# EAGLE design hw-art_v1 (EAGLE 6.1)
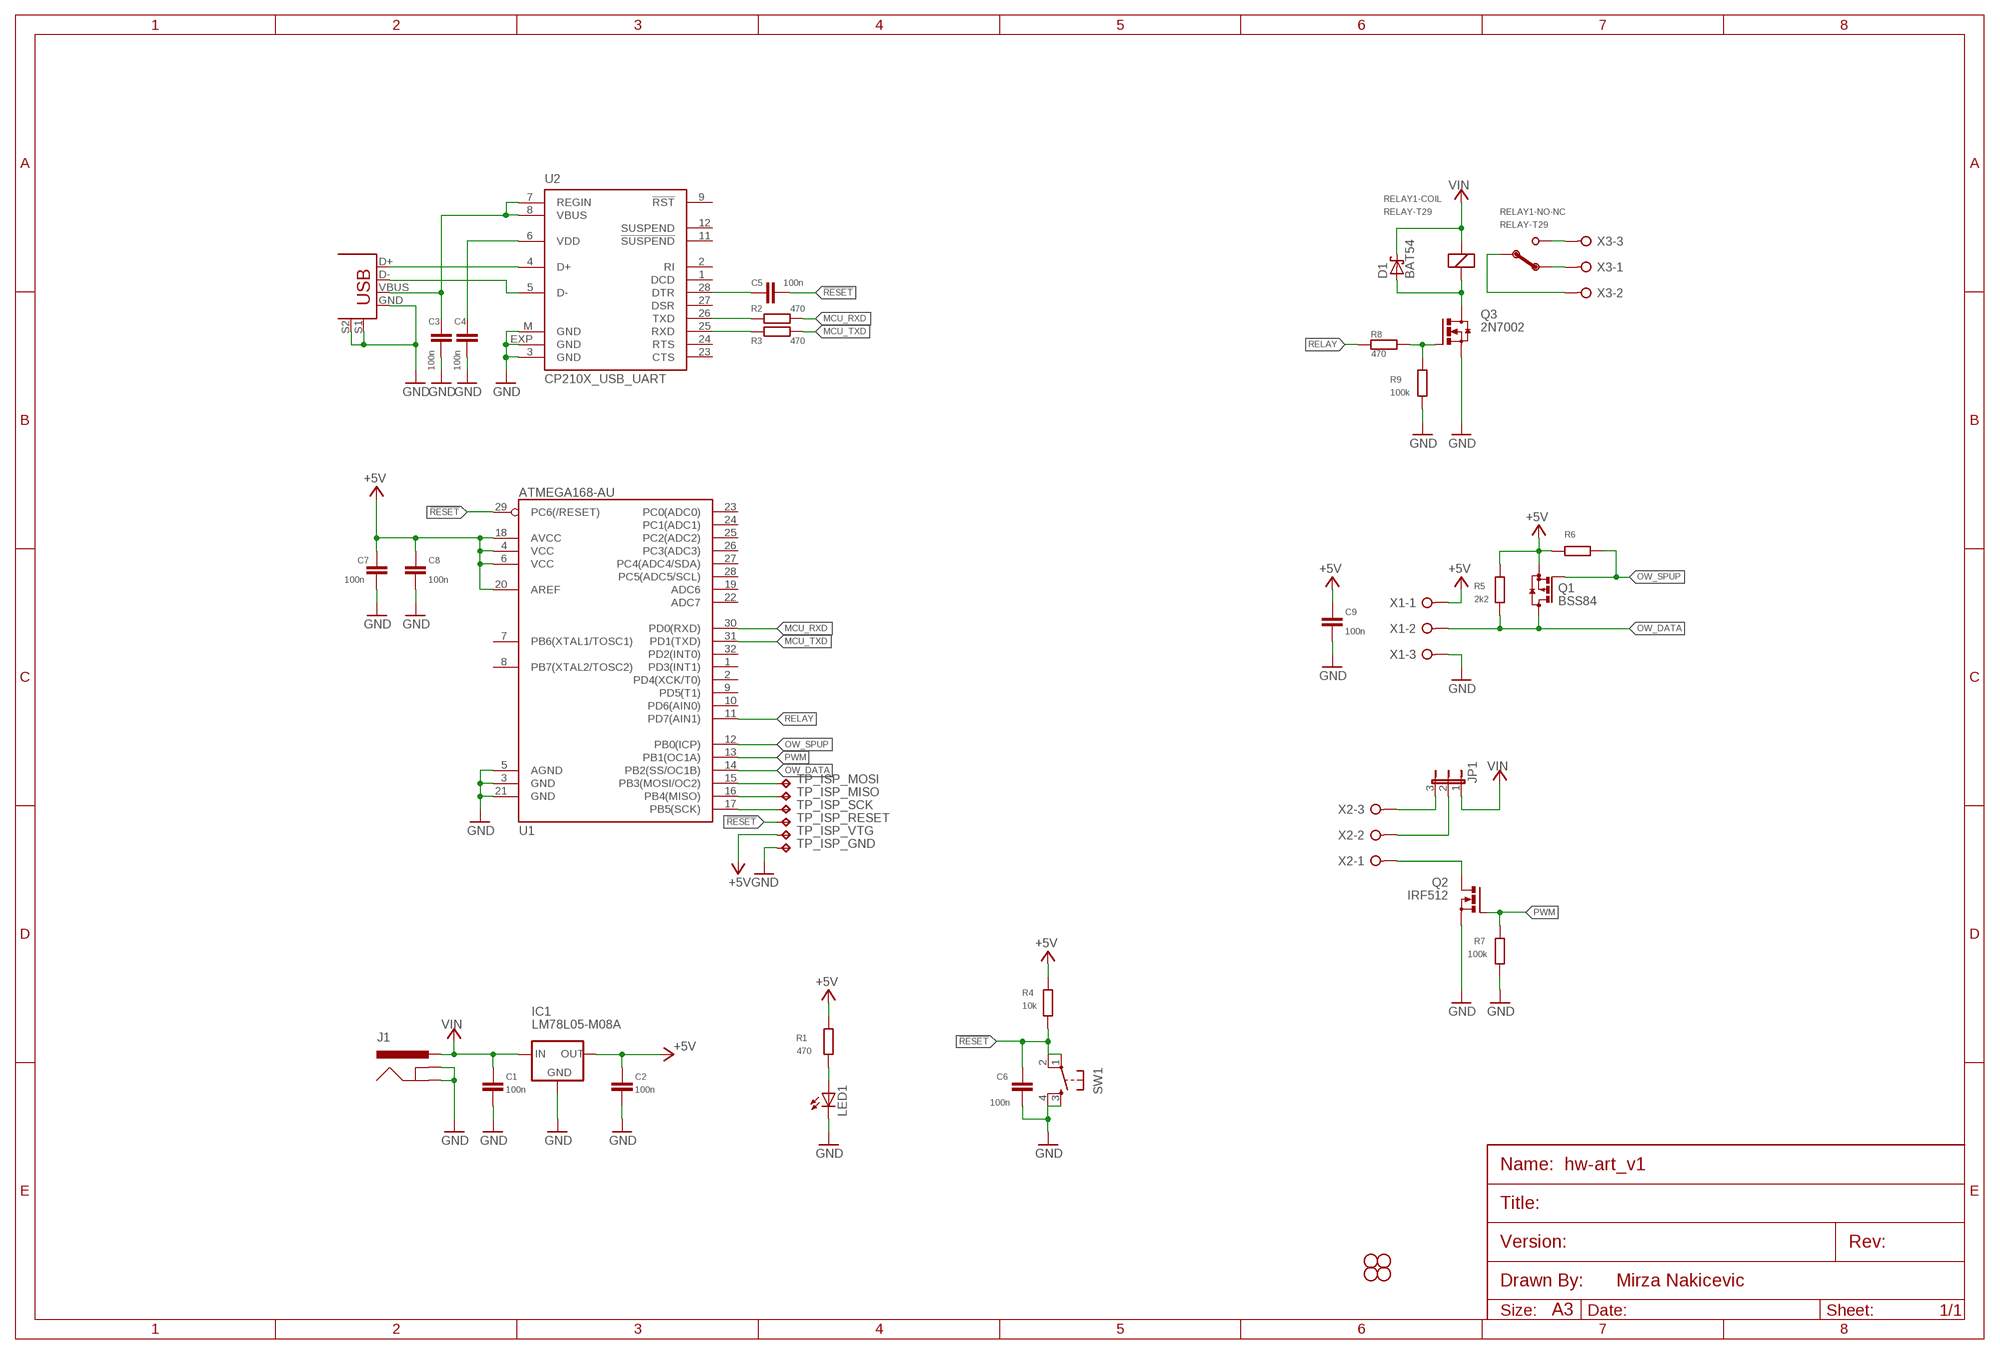
[diagram p0: schematic, sheet 1]

## Parts
C1  100n  C-0603  [C0603]
C2  100n  C-0603  [C0603]
C3  100n  C-0603  [C0603]
C4  100n  C-0603  [C0603]
C5  100n  C-0603  [C0603]
C6  100n  C-0603  [C0603]
C7  100n  C-0603  [C0603]
C8  100n  C-0603  [C0603]
C9  100n  C-0603  [C0603]
D1  BAT54  [SOT23]
IC1  LM78L05-M08A  [SO-08]
J1  DCJACK-05537  [4UCON-05537]
J2  USB+SHIELD  [USB-B-PTH]
JP1  JP2E  [JP2]
LED1  LEDCHIP-LED0805  [CHIP-LED0805]
Q1  BSS84  [SOT23]
Q2  IRF512  [TO220BV]
Q3  2N7002  [SOT-23]
R1  470  R-0603  [R0603]
R2  470  R-0603  [R0603]
R3  470  R-0603  [R0603]
R4  10k  R-0603  [R0603]
R5  2k2  R-0603  [R0603]
R6  R-0603  [R0603]
R7  100k  R-0603  [R0603]
R8  470  R-0603  [R0603]
R9  100k  R-0603  [R0603]
RELAY1  RELAY-T29  [FINDER_T29]
SW1  TAC_SWITCHPTH  [TACTILE-PTH]
TP_ISP_GND  TPTP08R  [TP08R]
TP_ISP_MISO  TPTP08R  [TP08R]
TP_ISP_MOSI  TPTP08R  [TP08R]
TP_ISP_RESET  TPTP08R  [TP08R]
TP_ISP_SCK  TPTP08R  [TP08R]
TP_ISP_VTG  TPTP08R  [TP08R]
U1  ATMEGA168-AU  [TQFP32-08]
U2  CP210X_USB_UART  [MLP28]
U$1  STAND-OFF  [STAND-OFF]
U$2  STAND-OFF  [STAND-OFF]
U$3  STAND-OFF  [STAND-OFF]
U$4  STAND-OFF  [STAND-OFF]
X1  W237-03P  [W237-133]
X2  W237-03P  [W237-133]
X3  W237-03P  [W237-133]

## Nets
!RESET: C5.2 C6.2 R4.1 SW1.1 SW1.2 TP_ISP_RESET.TP U1.29(PC6(/RESET))
+5V: C2.1 C7.1 C8.1 C9.1 IC1.1(OUT) Q1.2(S) R1.2 R4.2 R5.2 R6.1 TP_ISP_VTG.TP U1.4(VCC) U1.6(VCC) U1.18(AVCC) U1.20(AREF) X1.1
GND: C1.2 C2.2 C3.2 C4.2 C6.1 C7.2 C8.2 C9.2 IC1.2(GND) IC1.3(GND) IC1.6(GND) IC1.7(GND) J1.2(GND) J1.3(GNDBREAK) J2.GND J2.S1 J2.S2 LED1.C Q2.S Q3.2(S) R7.2 R9.1 SW1.3 SW1.4 TP_ISP_GND.TP U1.3(GND) U1.5(AGND) U1.21(GND) U2.3(GND) U2.EXP(GND) U2.M(GND) X1.3
MCU_RXD: R2.2 U1.30(PD0(RXD))
MCU_TXD: R3.2 U1.31(PD1(TXD))
N$1: J2.D+ U2.4(D+)
N$2: J2.D- U2.5(D-)
N$3: C4.1 U2.6(VDD)
N$4: R2.1 U2.26(TXD)
N$5: R3.1 U2.25(RXD)
N$6: C5.1 U2.28(DTR)
N$7: RELAY1.NC(-NO-NC:NC) X3.1
N$9: Q2.D X2.1
N$10: JP1.3 X2.3
N$11: LED1.A R1.1
N$12: JP1.2 X2.2
N$13: TP_ISP_MOSI.TP U1.15(PB3(MOSI/OC2))
N$14: TP_ISP_MISO.TP U1.16(PB4(MISO))
N$15: TP_ISP_SCK.TP U1.17(PB5(SCK))
N$16: RELAY1.NO(-NO-NC:NO) X3.3
N$18: D1.1(A) Q3.3(D) RELAY1.-
N$19: RELAY1.COM(-NO-NC:COM) X3.2
N$22: Q3.1(G) R8.1 R9.2
OW_DATA: Q1.3(D) R5.1 U1.14(PB2(SS/OC1B)) X1.2
OW_SPUP: Q1.1(G) R6.2 U1.12(PB0(ICP))
PWM: Q2.G R7.1 U1.13(PB1(OC1A))
RELAY: R8.2 U1.11(PD7(AIN1))
VBUS: C3.1 J2.VBUS U2.7(REGIN) U2.8(VBUS)
VIN: C1.1 D1.3(C) IC1.8(IN) J1.1(PWR) JP1.1 RELAY1.+
Unconnected: U1.1(PD3(INT1)) U1.2(PD4(XCK/T0)) U1.7(PB6(XTAL1/TOSC1)) U1.8(PB7(XTAL2/TOSC2)) U1.9(PD5(T1)) U1.10(PD6(AIN0)) U1.19(ADC6) U1.22(ADC7) U1.23(PC0(ADC0)) U1.24(PC1(ADC1)) U1.25(PC2(ADC2)) U1.26(PC3(ADC3)) U1.27(PC4(ADC4/SDA)) U1.28(PC5(ADC5/SCL)) U1.32(PD2(INT0)) U2.1(DCD) U2.2(RI) U2.9(!RST) U2.11(!SUSPEND) U2.12(SUSPEND) U2.23(CTS) U2.24(RTS) U2.27(DSR)

## Notes on the sheet
- Mirza Nakicevic

## Library data of the parts
C1-C9 = rlc:C: Capacitor Standard SMD ceramic and 0.1" leaded capacitors.
D1 = diode:BAT54: Schottky Diodes Source: Fairchild .. BAT54.pdf
IC1 = ic-dcdc:LM78L05
J1 = con-jack:DCJACK
J2 = SparkFun:USB+SHIELD: USB+Shield USB connector with shield pins connectable
JP1 = jumper:JP2E: JUMPER
LED1 = led:LED: LED OSRAM: - CHIPLED LG R971, LG N971, LY N971, LG Q971, LY Q971, LO R971, LY R971 LH N974, LH R974 LS Q976, LO Q976, LY Q976 LO Q996 - Hyper CHIPLED LW Q18S LB Q993, LB Q99A, LB R99A - SideLED LS A670, LO A670, LY A670, LG A670, LP A670 LB A673, LV A673, LT A673, LW A673 LH A674 LY A675 LS A676, LA A676, LO A676, LY A676, LW A676 LS A679, LY A679, LG A679 - Hyper Micro SIDELED® LS Y876, LA Y876, LO Y876, LY Y876 LT Y87S - SmartLED LW L88C, LW L88S LB L89C, LB L89S, LG L890 LS L89K, LO L89K, LY L89K LS L896, LA L896, LO L896, LY L896 - TOPLED LS T670, LO T670, LY T670, LG T670, LP T670 LSG T670, LSP T670, LSY T670, LOP T670, LYG T670 LG T671, LOG T671, LSG T671 LB T673, LV T673, LT T673, LW T673 LH T674 LS T676, LA T676, LO T676, LY T676, LB T676, LH T676, LSB T676, LW T676 LB T67C, LV T67C, LT T67C, LS T67K, LO T67K, LY T67K, LW E67C LS E67B, LA E67B, LO E67B, LY E67B, LB E67C, LV E67C, LT E67C LW T67C LS T679, LY T679, LG T679 LS T770, LO T770, LY T770, LG T770, LP T770 LB T773, LV T773, LT T773, LW T773 LH T774 LS E675, LA E675, LY E675, LS T675 LS T776, LA T776, LO T776, LY T776, LB T776 LHGB T686 LT T68C, LB T68C - Hyper Mini TOPLED® LB M676 - Mini TOPLED Santana® LG M470 LS M47K, LO M47K, LY M47K Source: http://www.osram.convergy.de LUXEON: - LUMILED® LXK2-PW12-R00, LXK2-PW12-S00, LXK2-PW14-U00, LXK2-PW14-V00 LXK2-PM12-R00, LXK2-PM12-S00, LXK2-PM14-U00 LXK2-PE12-Q00, LXK2-PE12-R00, LXK2-PE12-S00, LXK2-PE14-T00, LXK2-PE14-U00 LXK2-PB12-K00, LXK2-PB12-L00, LXK2-PB12-M00, LXK2-PB14-N00, LXK2-PB14-P00, LXK2-PB14-Q00 LXK2-PR12-L00, LXK2-PR12-M00, LXK2-PR14-Q00, LXK2-PR14-R00 LXK2-PD12-Q00, LXK2-PD12-R00, LXK2-PD12-S00 LXK2-PH12-R00, LXK2-PH12-S00 LXK2-PL12-P00, LXK2-PL12-Q00, LXK2-PL12-R00 Source: www.luxeon.com KINGBRIGHT: KA-3528ASYC Source: www.kingbright.com
Q1 = transistor-small-signal:BSS84: P-CHANNEL MOS FET
Q2 = transistor-power:IRF512: N-CHANNEL MOS FET
Q3 = transistor-fet:2N7002
R1-R9 = rlc:R: Resistor Basic schematic elements and footprints for 0603, 1206, and PTH 1/10th watt (small) resistors.
RELAY1 = relay:RELAY
SW1 = switch:TAC_SWITCH: Momentary Switch Button commonly used for reset or general input.
TP_ISP_GND TP_ISP_MISO TP_ISP_MOSI TP_ISP_RESET TP_ISP_SCK TP_ISP_VTG = testpad:TP: Test pad
U1 = mcu-avr:ATMEGA168
U2 = SparkFun:CP210X_USB_UART: Single-Chip USB to UART Bridge Source: www.silabs.com .. CP2101.pdf / cp2102.pdf. Spark Fun Electronics SKU : COM-00310
U$1-U$4 = other:STAND-OFF: Stand Off This is the mechanical footprint for a #4 phillips button head screw. Use the keepout ring to avoid running the screw head into surrounding components.
X1-X3 = con-wago-508:W237-03P: WAGO SREW CLAMP; OC_FARNELL: unknown; OC_NEWARK: unknown

## Board
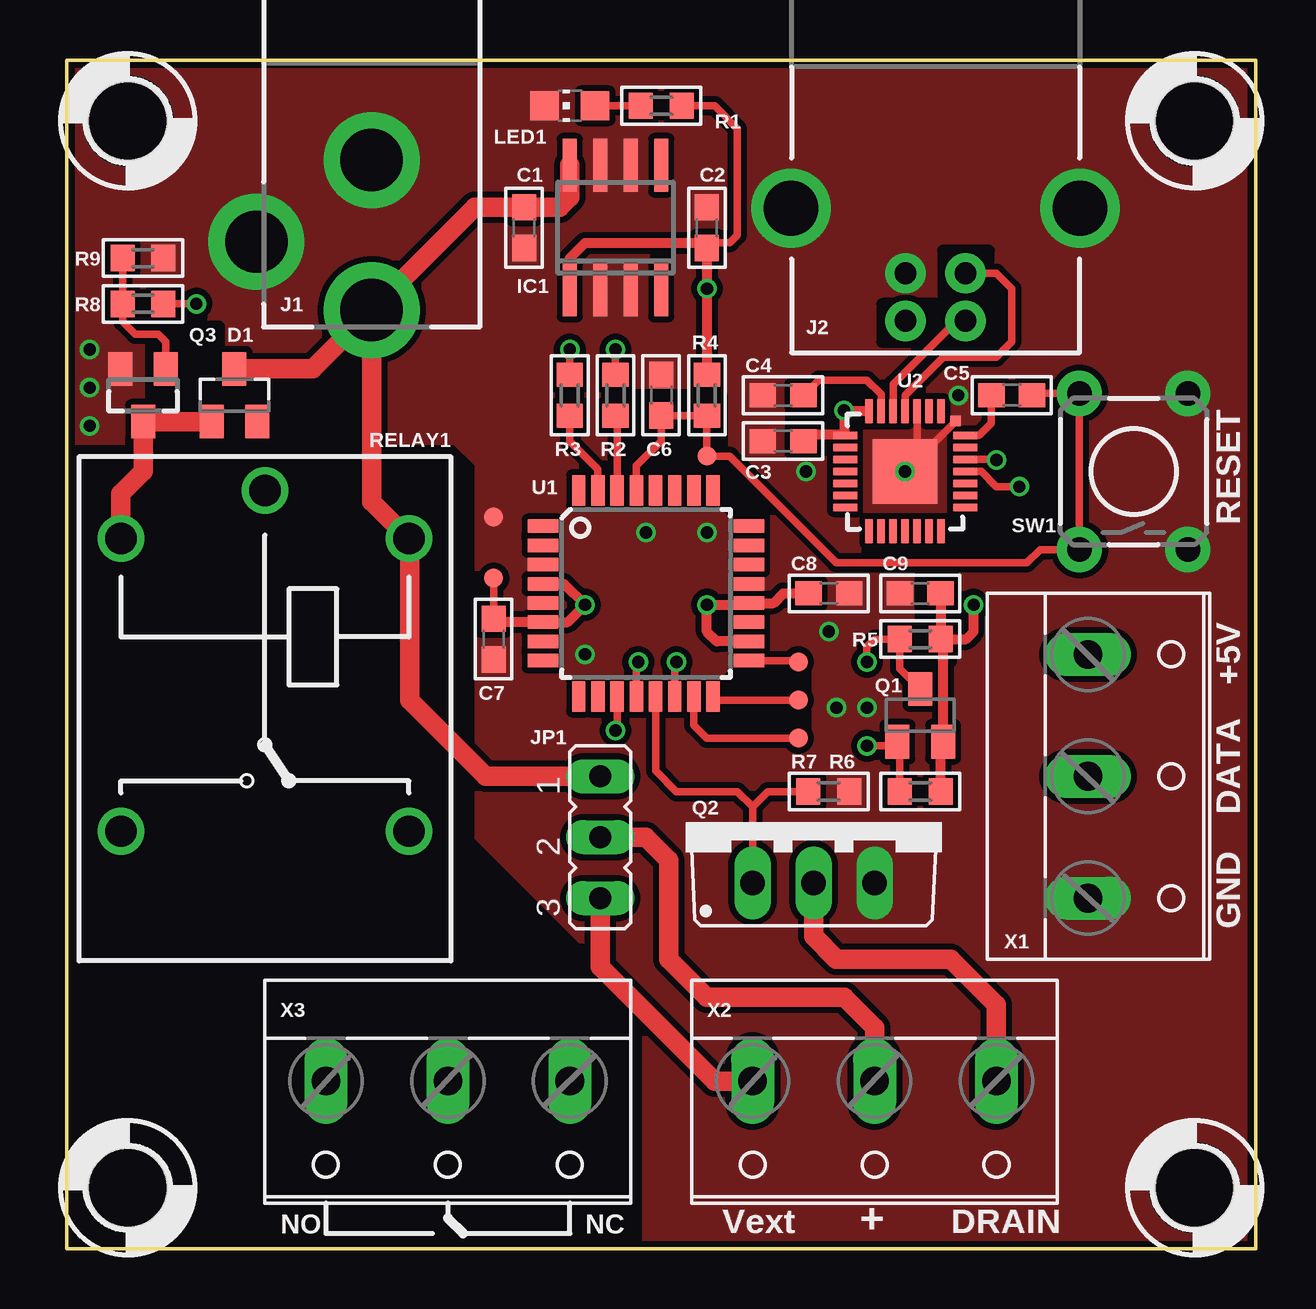
[diagram p1: board, top side]
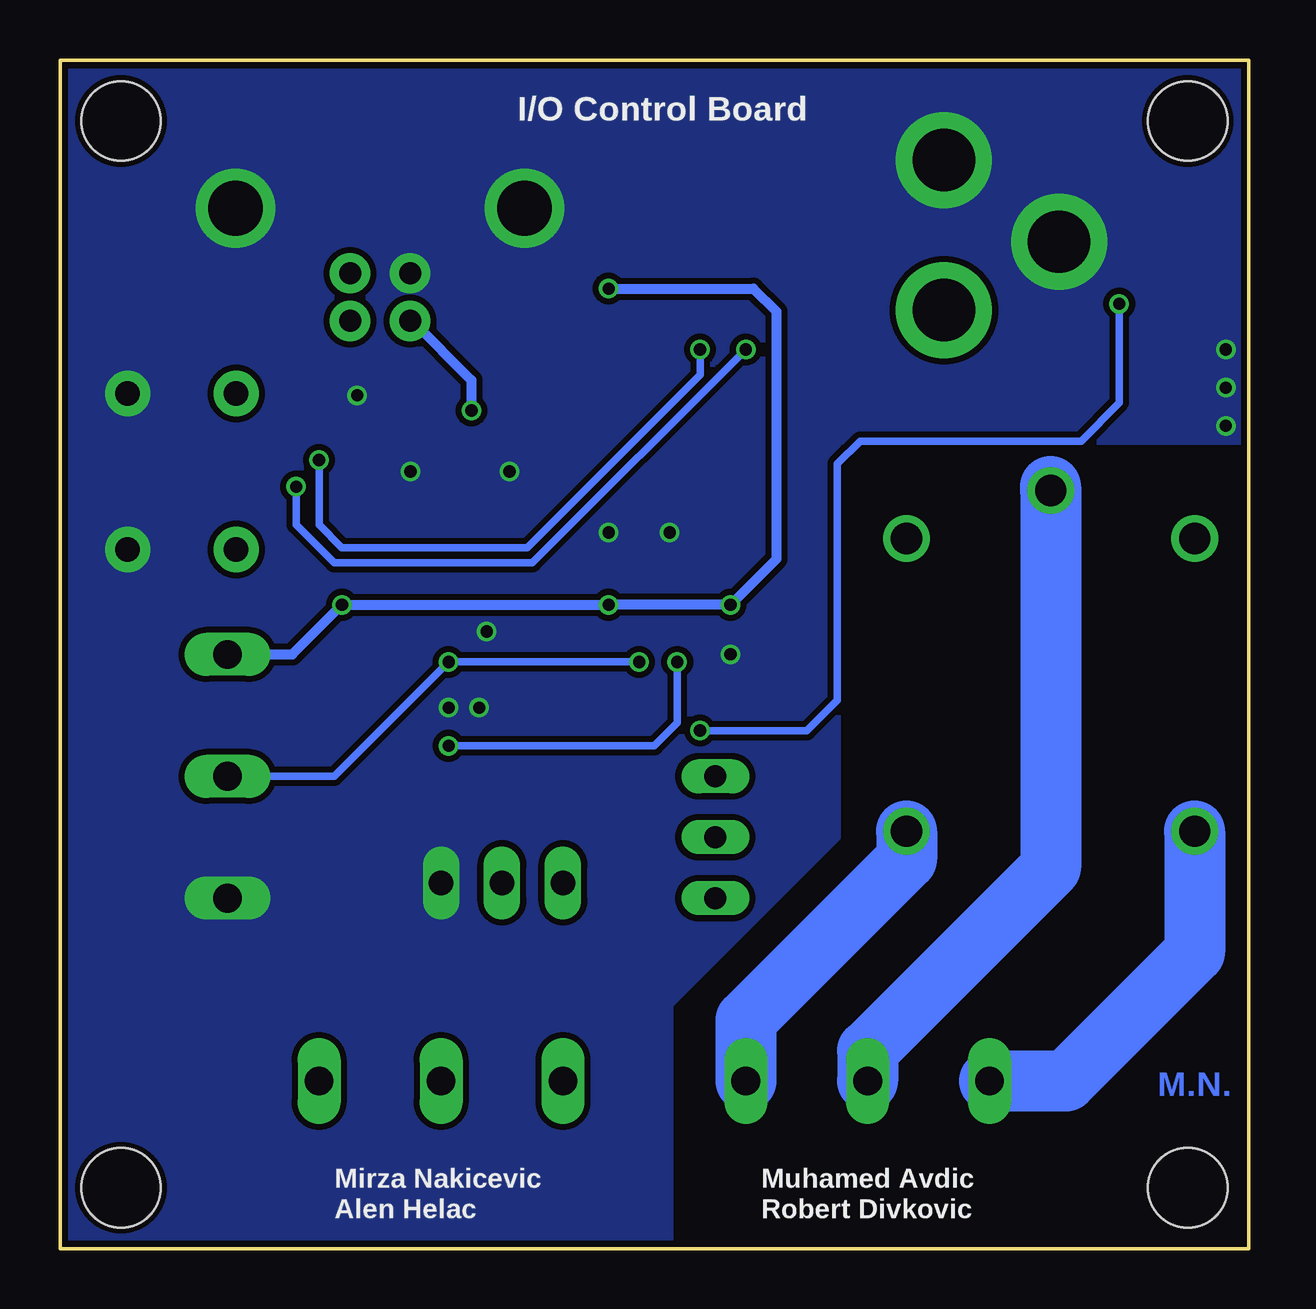
[diagram p2: board, bottom side, seen from below]

Size 49.53 x 49.53 mm. Coordinates in mm from the lower left corner, seen from the top.
Outline: 0,0 49.53,0 49.53,49.53 0,49.53 0,0
Copper layers (1*16): Top 0.035mm / dielectric 1.5mm / Bottom 0.035mm
Design rules: minimum track width 6mil, minimum drill 12mil, track to track 6mil, track to pad 6mil, pad to pad 6mil, via to via 6mil, smd to smd 0mil, copper to edge 10mil, drill to drill 10mil, minimum pad ring 10mil, minimum via ring 6mil, stop-mask expansion 2mil, vias tented up to drill 100mil, thermal gap 10mil
tRestrict: area 3.5,35.2 to 6.3,38.4; area 23.5,32.4 to 27.3,35.6; area 30.2,33.3 to 31.4,35.9; area 27.6,30.8 to 28.6,31.8; area 36.5,37.8 to 38.4,41.6; area 34,37.8 to 36.5,39.4; area 35.6,24.4 to 36.8,28.3; area 29.2,21.3 to 30.8,24.4; area 27.6,23.2 to 29.2,23.8

### Footprints (pad centres in the part's own frame; a part is rotated, then mirrored left to right if it is on the bottom)
C0603 = smd 1.1 x 1: 1 -0.85,0; 2 0.85,0
SOT23 = smd 1 x 1.4: 1 -0.95,-1.1; 2 0.95,-1.1; 3 0,1.1
SO-08 = smd 0.6 x 2.2: 1 -1.905,-2.6; 2 -0.635,-2.6; 3 0.635,-2.6; 4 1.905,-2.6; 5 1.905,2.6; 6 0.635,2.6; 7 -0.635,2.6; 8 -1.905,2.6
4UCON-05537 = drill 2.6 pad 4: 1 9.79,0; 2 3.54,0; 3 6.94,-4.8
USB-B-PTH = drill 0.914 pad 1.676: D+ 0,1.25; D- 1.981,1.25; GND 0,-1.25; VBUS 1.981,-1.25 | drill 2.286: S1 -2.718,-6.02; S2 -2.718,6.02
JP2 = drill 0.914 long: 1 -2.54,0; 2 0,0; 3 2.54,0
CHIP-LED0805 = smd 1.2 x 1.2: A 0,-1.05; C 0,1.05
TO220BV = drill 1.016 long: D 0,-2.54; G -2.54,-2.54; S 2.54,-2.54
SOT-23 = smd 1 x 1.4: 1 -0.95,-1.1; 2 0.95,-1.1; 3 0,1.1
R0603 = smd 1 x 1.1: 1 -0.85,0; 2 0.85,0
FINDER_T29 = drill 1.3: + -6.1,6; - -6.1,-6; COM -8.1,0; NC 6.1,6; NO 6.1,-6
TACTILE-PTH = drill 1.016 pad 1.88: 1 -3.251,2.261; 2 3.251,2.261; 3 -3.251,-2.261; 4 3.251,-2.261
TP08R = smd 0.8 x 0.8: TP 0,0
TQFP32-08 = smd 1.27 x 0.559: 1 -4.293,2.8; 2 -4.293,2; 3 -4.293,1.2; 4 -4.293,0.4; 5 -4.293,-0.4; 6 -4.293,-1.2; 7 -4.293,-2; 8 -4.293,-2.8; 17 4.293,-2.8; 18 4.293,-2; 19 4.293,-1.2; 20 4.293,-0.4; 21 4.293,0.4; 22 4.293,1.2; 23 4.293,2; 24 4.293,2.8 | smd 0.559 x 1.27: 9 -2.8,-4.293; 10 -2,-4.293; 11 -1.2,-4.293; 12 -0.4,-4.293; 13 0.4,-4.293; 14 1.2,-4.293; 15 2,-4.293; 16 2.8,-4.293; 25 2.8,4.293; 26 2,4.293; 27 1.2,4.293; 28 0.4,4.293; 29 -0.4,4.293; 30 -1.2,4.293; 31 -2,4.293; 32 -2.8,4.293
MLP28 = smd 1 x 0.3: 1 -2.5,1.5; 2 -2.5,1; 3 -2.5,0.5; 4 -2.5,0; 5 -2.5,-0.5; 6 -2.5,-1; 7 -2.5,-1.5; 15 2.5,-1.5; 16 2.5,-1; 17 2.5,-0.5; 18 2.5,0; 19 2.5,0.5; 20 2.5,1; 21 2.5,1.5 | smd 0.3 x 1: 8 -1.5,-2.5; 9 -1,-2.5; 10 -0.5,-2.5; 11 0,-2.5; 12 0.5,-2.5; 13 1,-2.5; 14 1.5,-2.5; 22 1.5,2.5; 23 1,2.5; 24 0.5,2.5; 25 0,2.5; 26 -0.5,2.5; 27 -1,2.5; 28 -1.5,2.5 | smd 2.7 x 2.7: EXP 0,0 | smd 0.435 x 0.435: M -2.103,2.103
STAND-OFF = hole 3.302: 0,0
W237-133 = drill 1.194 long: 1 -5.08,-0.635; 2 0,-0.635; 3 5.08,-0.635

### Placement (x,y rotation side)
C1  19.05,42.55 270 top
C2  26.67,42.55 90 top
C3  29.84,33.66 180 top
C4  29.84,35.56 180 top
C5  39.37,35.56 0 top
C6  24.77,35.56 270 top
C7  17.78,25.4 270 top
C8  31.75,27.3 0 top
C9  35.56,27.3 180 top
D1  6.99,35.56 0 top
IC1  22.86,42.55 0 top
J1  12.7,48.9 270 top
J2  36.2,40.64 270 top
JP1  22.23,17.14 270 top
LED1  20.95,47.62 90 top
Q1  35.56,22.23 0 top
Q2  31.11,17.78 0 top
Q3  3.17,35.56 180 top
R1  24.77,47.62 0 top
R2  22.86,35.56 270 top
R3  20.95,35.56 270 top
R4  26.67,35.56 90 top
R5  35.56,25.4 0 top
R6  35.56,19.05 180 top
R7  31.75,19.05 0 top
R8  3.17,39.37 0 top
R9  3.17,41.27 180 top
RELAY1  8.26,23.5 270 top
SW1  44.45,32.38 90 top
TP_ISP_GND  17.78,30.48 0 top
TP_ISP_MISO  30.48,22.86 0 top
TP_ISP_MOSI  30.48,21.27 0 top
TP_ISP_RESET  26.67,33.02 0 top
TP_ISP_SCK  30.48,24.45 0 top
TP_ISP_VTG  17.78,27.94 90 top
U1  24.13,27.3 0 top
U2  34.92,32.38 270 top
U$1  2.54,2.54 0 top
U$2  46.99,2.54 0 top
U$3  2.54,46.99 0 top
U$4  46.99,46.99 0 top
X1  43.18,19.68 270 top
X2  33.66,6.35 180 top
X3  15.88,6.35 180 top

### Tracks (layer width: path | path; a pad name or v marks a point on that pad's centre or on a via)
!RESET
  Top 0.305: C5.2 40.3,35.64 SW1.2 SW1.1 40.56,29.13 40.01,28.57 32.07,28.57 27.62,33.02 TP_ISP_RESET.TP R4.1 C6.2 24.77,33.66 23.73,32.62 U1.29
+5V  (via drill 0.51)
  Top 0.305: 26.45,41.91 27.62,41.91 27.94,42.23 27.94,46.67 26.99,47.62 R1.2 | 36.41,21.02 Q1.2 | 18.03,26.11 17.78,26.35 | TP_ISP_VTG.TP 17.78,26.35 | 17.78,26.35 C7.1
  Top 0.406: IC1.1 20.95,41.27 21.59,41.91 26.45,41.91 C2.1 v26.67,40.01 R4.2 | R6.1 36.41,21.02 | Q1.2 36.51,25.3 R5.2 | U1.18 27.08,25.3 26.67,25.72 v26.67,26.83 28.35,26.83 U1.20 29.45,26.91 29.84,27.3 C8.1 | R5.2 37.47,25.4 37.78,25.72 v37.78,26.83 | C9.1 R5.2 | 18.03,26.11 U1.6 20.87,26.11 v21.59,26.83 20.71,27.7 U1.4
  Bottom 0.406: v26.67,40.01 20.64,40.01 19.68,39.05 19.68,28.73 v21.59,26.83 v26.67,26.83 v37.78,26.83 39.85,24.77 X1.1
GND  (via drill 0.51)
  Top 0.305: U2.3 35.42,32.88 U2.EXP U2.M
  other vias: 34.92,32.38 0.95,34.29 0.95,35.88 0.95,37.47 30.8,32.38 37.15,35.56 21.59,24.77 26.67,29.84 33.34,22.54 31.75,25.72 32.07,22.54 24.13,29.84
  pour Top (isolate 0.254, no thermals): 0,49.53 49.53,49.53 49.53,0 24.13,0 24.13,10.16 17.14,17.14 17.14,32.7 16.19,33.66 0,33.66
  pour Bottom (isolate 0.254, no thermals): 0,49.53 49.53,49.53 49.53,0 24.13,0 24.13,10.16 17.14,17.14 17.14,33.66 0,33.66
MCU_RXD
  Top 0.305: U1.30 22.93,34.64 R2.2
MCU_TXD
  Top 0.305: U1.31 22.13,32.48 20.95,33.66 20.95,34.61 R3.2 20.95,34.92
N$1
  Top 0.305: U2.4 34.92,35.56 36.51,37.15 38.73,37.15 39.37,37.78 39.37,40.01 38.73,40.64 J2.D+
N$2
  Top 0.305: U2.5 34.42,36.01 36.83,38.42 37.2,38.42 J2.D-
N$3
  Top 0.305: U2.6 33.92,35.61 33.34,36.2 31.33,36.2 C4.1
N$4  (via drill 0.51)
  Top 0.305: R2.1 v22.86,37.47 | U2.26 38.6,32.88 v38.73,32.86
  Bottom 0.305: v38.73,32.86 38.73,30.16 37.78,29.21 30.06,29.21 R2.1 v22.86,37.47
N$5  (via drill 0.51)
  Top 0.305: R3.1 v20.95,37.47 | U2.25 38.1,32.38 38.73,31.75 v39.69,31.75
  Bottom 0.305: v39.69,31.75 39.69,30.16 38.1,28.57 29.84,28.57 v20.95,37.47
N$6
  Top 0.305: U2.28 38.01,33.88 38.52,34.39 C5.1
N$7
  Bottom 2.54: RELAY1.NC 14.26,16.23 20.95,9.53 X3.1
N$9
  Top 0.813: Q2.D 31.11,13.02 32.07,12.06 36.83,12.06 38.73,10.16 X2.1
N$10
  Top 0.813: JP1.3 22.23,11.75 26.99,6.99 X2.3
N$11
  Top 0.305: LED1.A R1.1
N$12
  Top 0.813: JP1.2 24.13,17.14 25.08,16.19 25.08,12.06 26.67,10.48 32.38,10.48 33.66,9.21 X2.2
N$13
  Top 0.305: U1.15 26.13,21.81 26.67,21.27 TP_ISP_MOSI.TP
N$14
  Top 0.305: TP_ISP_MISO.TP 27.08,22.86 U1.16
N$15
  Top 0.305: U1.17 30.42,24.5 TP_ISP_SCK.TP
N$16
  Bottom 2.54: RELAY1.NO 2.25,12.35 7.62,6.99 X3.3
N$18
  Top 0.305: 5.88,34.46 D1.1
  Top 0.813: RELAY1.- 2.25,31.46 3.17,32.38 Q3.3 5.88,34.46 6.03,34.61
N$19
  Bottom 2.54: X3.2 15.88,8.26 8.26,15.88 RELAY1.COM 8.26,31.75
N$22
  Top 0.305: R9.2 R8.1 2.33,38.63 2.86,38.1 3.81,38.1 4.12,37.78 Q3.1
OW_DATA  (via drill 0.51)
  Top 0.305: U1.14 25.33,24.38 v25.4,24.45 | Q1.3 34.71,24.18 R5.1 33.66,25.4 33.34,25.08 v33.34,24.45
  Bottom 0.305: v25.4,24.45 v33.34,24.45 38.1,19.68 X1.2
OW_SPUP  (via drill 0.51)
  Top 0.305: U1.12 23.73,24.36 v23.81,24.45 | v33.34,20.95 34.44,20.95 Q1.1 34.71,21.02 R6.2
  Bottom 0.305: v33.34,20.95 24.77,20.95 23.81,21.91 v23.81,24.45
PWM
  Top 0.305: Q2.G 28.57,18.41 | 28.57,18.41 29.21,19.05 R7.1 | U1.13 24.53,19.92 25.4,19.05 27.94,19.05 28.57,18.41
RELAY  (via drill 0.51)
  Top 0.305: U1.11 22.93,21.66 v22.86,21.59 | R8.2 v5.4,39.37
  Bottom 0.305: v5.4,39.37 5.4,35.24 6.99,33.66 16.19,33.66 17.14,32.7 17.14,22.86 18.41,21.59 v22.86,21.59
VBUS  (via drill 0.51)
  Top 0.305: 32.38,33.92 U2.8 | 30.96,33.92 C3.1 | U2.7 33.38,34.88 33.34,34.92
  Top 0.406: 33.34,34.92 v32.38,34.92 32.38,33.92 30.96,33.92
  Bottom 0.406: J2.VBUS 34.85,38.66 32.38,36.2 v32.38,34.92
VIN
  Top 0.305: J1.1 12.7,39.05
  Top 0.813: D1.3 10.26,36.66 J1.1 16.99,43.4 C1.1 20.54,43.4 20.95,43.81 IC1.8 | JP1.1 17.46,19.68 14.29,22.86 14.29,29.56 RELAY1.+ 14.22,29.59 12.7,31.11 12.7,38.73 12.7,39.05

### Text on the board
Bottom: M.N.
tPlace: RESET | +5V | DATA | GND | NO | NC | Vext | + | DRAIN
bPlace: I/O Control Board | Muhamed Avdic | Mirza Nakicevic | Robert Divkovic | Alen Helac